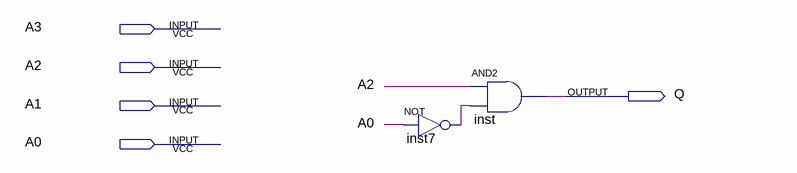
[diagram p0: schematic sheet]
// Quartus schematic Activation.bdf as structural Verilog: 2 symbols, 5 pins
module Activation (
  input  A3,
  input  A2,
  input  A1,
  input  A0,
  output Q
);

  wire inst7_out;

  not inst7 (inst7_out, A0);
  and inst (Q, A2, inst7_out);
endmodule
